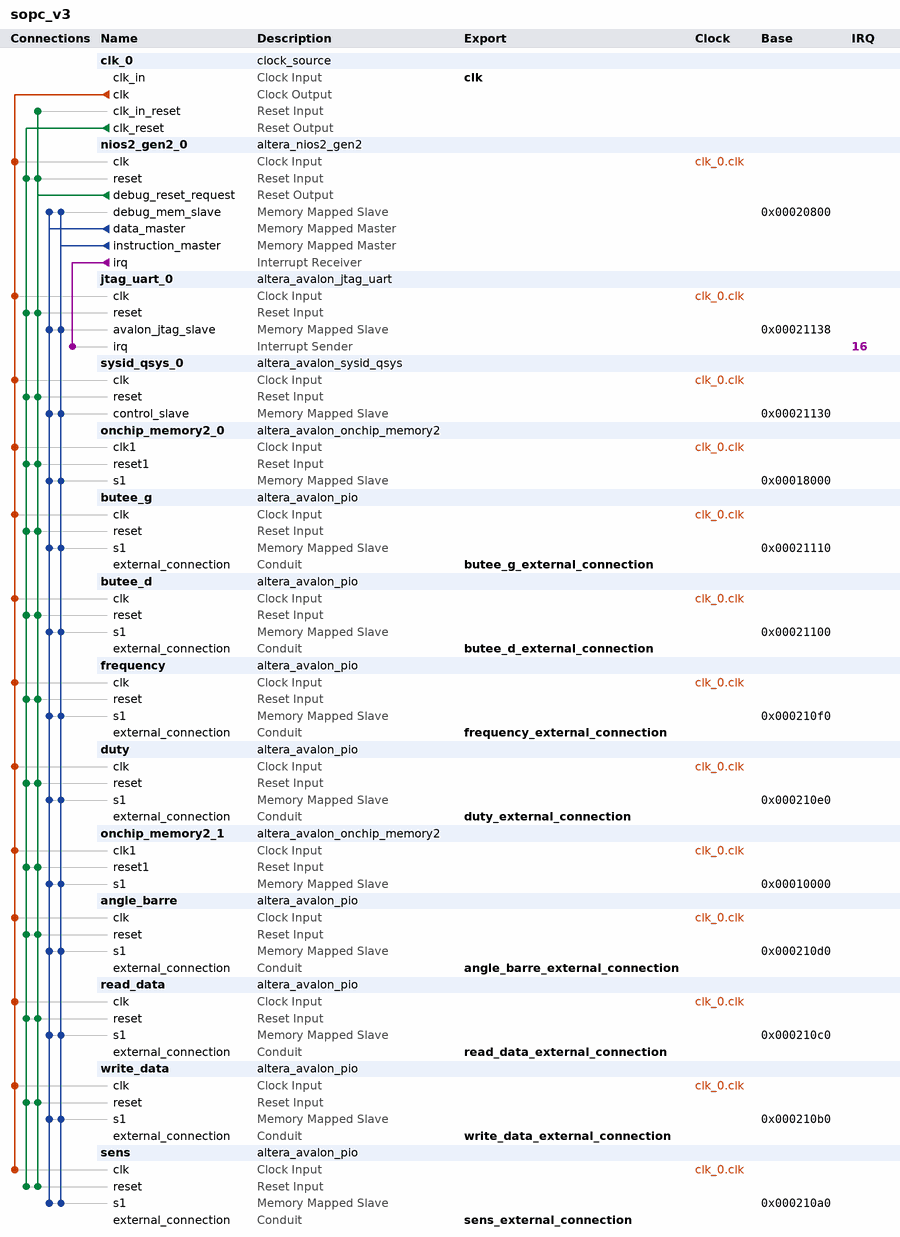
[diagram p0: system contents]
# Platform Designer (Qsys) system sopc_v3, Cyclone IV E EP4CE22F17C6
# Parameters at their usual value, and those the tool derives, are not listed.
package require -exact qsys 18.1
create_system sopc_v3
set_project_property DEVICE_FAMILY {Cyclone IV E}
set_project_property DEVICE EP4CE22F17C6

add_instance clk_0 clock_source 18.1
set_instance_parameter_value clk_0 clockFrequency 50000000

add_instance nios2_gen2_0 altera_nios2_gen2 18.1
set_instance_parameter_value nios2_gen2_0 dcache_size 2048
set_instance_parameter_value nios2_gen2_0 exceptionSlave onchip_memory2_0.s1
set_instance_parameter_value nios2_gen2_0 icache_size 4096
set_instance_parameter_value nios2_gen2_0 impl Tiny
set_instance_parameter_value nios2_gen2_0 resetSlave onchip_memory2_0.s1

add_instance jtag_uart_0 altera_avalon_jtag_uart 18.1
set_instance_parameter_value jtag_uart_0 readIRQThreshold 16
set_instance_parameter_value jtag_uart_0 simInteractiveOptions NO_INTERACTIVE_WINDOWS
set_instance_parameter_value jtag_uart_0 writeIRQThreshold 16

add_instance sysid_qsys_0 altera_avalon_sysid_qsys 18.1
set_instance_parameter_value sysid_qsys_0 id 5639

add_instance onchip_memory2_0 altera_avalon_onchip_memory2 18.1
set_instance_parameter_value onchip_memory2_0 dataWidth 32
set_instance_parameter_value onchip_memory2_0 dualPort false
set_instance_parameter_value onchip_memory2_0 initMemContent true
set_instance_parameter_value onchip_memory2_0 initializationFileName onchip_mem.hex
set_instance_parameter_value onchip_memory2_0 memorySize 20000

add_instance butee_g altera_avalon_pio 18.1
set_instance_parameter_value butee_g direction Output
set_instance_parameter_value butee_g width 12

add_instance butee_d altera_avalon_pio 18.1
set_instance_parameter_value butee_d direction Output
set_instance_parameter_value butee_d width 12

add_instance frequency altera_avalon_pio 18.1
set_instance_parameter_value frequency direction Output
set_instance_parameter_value frequency width 16

add_instance duty altera_avalon_pio 18.1
set_instance_parameter_value duty direction Output
set_instance_parameter_value duty width 16

add_instance onchip_memory2_1 altera_avalon_onchip_memory2 18.1
set_instance_parameter_value onchip_memory2_1 dataWidth 32
set_instance_parameter_value onchip_memory2_1 dualPort false
set_instance_parameter_value onchip_memory2_1 initMemContent true
set_instance_parameter_value onchip_memory2_1 initializationFileName onchip_mem.hex
set_instance_parameter_value onchip_memory2_1 memorySize 20000

add_instance angle_barre altera_avalon_pio 18.1
set_instance_parameter_value angle_barre direction Input
set_instance_parameter_value angle_barre width 12

add_instance read_data altera_avalon_pio 18.1
set_instance_parameter_value read_data direction Output
set_instance_parameter_value read_data width 32

add_instance write_data altera_avalon_pio 18.1
set_instance_parameter_value write_data direction Input
set_instance_parameter_value write_data width 32

add_instance sens altera_avalon_pio 18.1
set_instance_parameter_value sens direction Output
set_instance_parameter_value sens width 1

# connections
add_connection clk_0.clk angle_barre.clk clock
add_connection clk_0.clk butee_d.clk clock
add_connection clk_0.clk butee_g.clk clock
add_connection clk_0.clk duty.clk clock
add_connection clk_0.clk frequency.clk clock
add_connection clk_0.clk jtag_uart_0.clk clock
add_connection clk_0.clk nios2_gen2_0.clk clock
add_connection clk_0.clk onchip_memory2_0.clk1 clock
add_connection clk_0.clk onchip_memory2_1.clk1 clock
add_connection clk_0.clk read_data.clk clock
add_connection clk_0.clk sens.clk clock
add_connection clk_0.clk sysid_qsys_0.clk clock
add_connection clk_0.clk write_data.clk clock
add_connection clk_0.clk_reset angle_barre.reset reset
add_connection clk_0.clk_reset butee_d.reset reset
add_connection clk_0.clk_reset butee_g.reset reset
add_connection clk_0.clk_reset duty.reset reset
add_connection clk_0.clk_reset frequency.reset reset
add_connection clk_0.clk_reset jtag_uart_0.reset reset
add_connection clk_0.clk_reset nios2_gen2_0.reset reset
add_connection clk_0.clk_reset onchip_memory2_0.reset1 reset
add_connection clk_0.clk_reset onchip_memory2_1.reset1 reset
add_connection clk_0.clk_reset read_data.reset reset
add_connection clk_0.clk_reset sens.reset reset
add_connection clk_0.clk_reset sysid_qsys_0.reset reset
add_connection clk_0.clk_reset write_data.reset reset
add_connection nios2_gen2_0.debug_reset_request angle_barre.reset reset
add_connection nios2_gen2_0.debug_reset_request butee_d.reset reset
add_connection nios2_gen2_0.debug_reset_request butee_g.reset reset
add_connection nios2_gen2_0.debug_reset_request clk_0.clk_in_reset reset
add_connection nios2_gen2_0.debug_reset_request duty.reset reset
add_connection nios2_gen2_0.debug_reset_request frequency.reset reset
add_connection nios2_gen2_0.debug_reset_request jtag_uart_0.reset reset
add_connection nios2_gen2_0.debug_reset_request nios2_gen2_0.reset reset
add_connection nios2_gen2_0.debug_reset_request onchip_memory2_0.reset1 reset
add_connection nios2_gen2_0.debug_reset_request onchip_memory2_1.reset1 reset
add_connection nios2_gen2_0.debug_reset_request read_data.reset reset
add_connection nios2_gen2_0.debug_reset_request sens.reset reset
add_connection nios2_gen2_0.debug_reset_request sysid_qsys_0.reset reset
add_connection nios2_gen2_0.debug_reset_request write_data.reset reset
add_connection nios2_gen2_0.data_master angle_barre.s1 avalon
set_connection_parameter_value nios2_gen2_0.data_master/angle_barre.s1 baseAddress 0x000210d0
add_connection nios2_gen2_0.data_master butee_d.s1 avalon
set_connection_parameter_value nios2_gen2_0.data_master/butee_d.s1 baseAddress 0x00021100
add_connection nios2_gen2_0.data_master butee_g.s1 avalon
set_connection_parameter_value nios2_gen2_0.data_master/butee_g.s1 baseAddress 0x00021110
add_connection nios2_gen2_0.data_master duty.s1 avalon
set_connection_parameter_value nios2_gen2_0.data_master/duty.s1 baseAddress 0x000210e0
add_connection nios2_gen2_0.data_master frequency.s1 avalon
set_connection_parameter_value nios2_gen2_0.data_master/frequency.s1 baseAddress 0x000210f0
add_connection nios2_gen2_0.data_master jtag_uart_0.avalon_jtag_slave avalon
set_connection_parameter_value nios2_gen2_0.data_master/jtag_uart_0.avalon_jtag_slave baseAddress 0x00021138
add_connection nios2_gen2_0.data_master nios2_gen2_0.debug_mem_slave avalon
set_connection_parameter_value nios2_gen2_0.data_master/nios2_gen2_0.debug_mem_slave baseAddress 0x00020800
add_connection nios2_gen2_0.data_master onchip_memory2_0.s1 avalon
set_connection_parameter_value nios2_gen2_0.data_master/onchip_memory2_0.s1 baseAddress 0x00018000
add_connection nios2_gen2_0.data_master onchip_memory2_1.s1 avalon
set_connection_parameter_value nios2_gen2_0.data_master/onchip_memory2_1.s1 baseAddress 0x00010000
add_connection nios2_gen2_0.data_master read_data.s1 avalon
set_connection_parameter_value nios2_gen2_0.data_master/read_data.s1 baseAddress 0x000210c0
add_connection nios2_gen2_0.data_master sens.s1 avalon
set_connection_parameter_value nios2_gen2_0.data_master/sens.s1 baseAddress 0x000210a0
add_connection nios2_gen2_0.data_master sysid_qsys_0.control_slave avalon
set_connection_parameter_value nios2_gen2_0.data_master/sysid_qsys_0.control_slave baseAddress 0x00021130
add_connection nios2_gen2_0.data_master write_data.s1 avalon
set_connection_parameter_value nios2_gen2_0.data_master/write_data.s1 baseAddress 0x000210b0
add_connection nios2_gen2_0.instruction_master angle_barre.s1 avalon
set_connection_parameter_value nios2_gen2_0.instruction_master/angle_barre.s1 baseAddress 0x000210d0
add_connection nios2_gen2_0.instruction_master butee_d.s1 avalon
set_connection_parameter_value nios2_gen2_0.instruction_master/butee_d.s1 baseAddress 0x00021100
add_connection nios2_gen2_0.instruction_master butee_g.s1 avalon
set_connection_parameter_value nios2_gen2_0.instruction_master/butee_g.s1 baseAddress 0x00021110
add_connection nios2_gen2_0.instruction_master duty.s1 avalon
set_connection_parameter_value nios2_gen2_0.instruction_master/duty.s1 baseAddress 0x000210e0
add_connection nios2_gen2_0.instruction_master frequency.s1 avalon
set_connection_parameter_value nios2_gen2_0.instruction_master/frequency.s1 baseAddress 0x000210f0
add_connection nios2_gen2_0.instruction_master jtag_uart_0.avalon_jtag_slave avalon
set_connection_parameter_value nios2_gen2_0.instruction_master/jtag_uart_0.avalon_jtag_slave baseAddress 0x00021138
add_connection nios2_gen2_0.instruction_master nios2_gen2_0.debug_mem_slave avalon
set_connection_parameter_value nios2_gen2_0.instruction_master/nios2_gen2_0.debug_mem_slave baseAddress 0x00020800
add_connection nios2_gen2_0.instruction_master onchip_memory2_0.s1 avalon
set_connection_parameter_value nios2_gen2_0.instruction_master/onchip_memory2_0.s1 baseAddress 0x00018000
add_connection nios2_gen2_0.instruction_master onchip_memory2_1.s1 avalon
set_connection_parameter_value nios2_gen2_0.instruction_master/onchip_memory2_1.s1 baseAddress 0x00010000
add_connection nios2_gen2_0.instruction_master read_data.s1 avalon
set_connection_parameter_value nios2_gen2_0.instruction_master/read_data.s1 baseAddress 0x000210c0
add_connection nios2_gen2_0.instruction_master sens.s1 avalon
set_connection_parameter_value nios2_gen2_0.instruction_master/sens.s1 baseAddress 0x000210a0
add_connection nios2_gen2_0.instruction_master sysid_qsys_0.control_slave avalon
set_connection_parameter_value nios2_gen2_0.instruction_master/sysid_qsys_0.control_slave baseAddress 0x00021130
add_connection nios2_gen2_0.instruction_master write_data.s1 avalon
set_connection_parameter_value nios2_gen2_0.instruction_master/write_data.s1 baseAddress 0x000210b0
add_connection nios2_gen2_0.irq jtag_uart_0.irq interrupt
set_connection_parameter_value nios2_gen2_0.irq/jtag_uart_0.irq irqNumber 16

# exported interfaces
add_interface angle_barre_external_connection conduit end
set_interface_property angle_barre_external_connection EXPORT_OF angle_barre.external_connection
add_interface butee_d_external_connection conduit end
set_interface_property butee_d_external_connection EXPORT_OF butee_d.external_connection
add_interface butee_g_external_connection conduit end
set_interface_property butee_g_external_connection EXPORT_OF butee_g.external_connection
add_interface clk clock sink
set_interface_property clk EXPORT_OF clk_0.clk_in
add_interface duty_external_connection conduit end
set_interface_property duty_external_connection EXPORT_OF duty.external_connection
add_interface frequency_external_connection conduit end
set_interface_property frequency_external_connection EXPORT_OF frequency.external_connection
add_interface read_data_external_connection conduit end
set_interface_property read_data_external_connection EXPORT_OF read_data.external_connection
add_interface sens_external_connection conduit end
set_interface_property sens_external_connection EXPORT_OF sens.external_connection
add_interface write_data_external_connection conduit end
set_interface_property write_data_external_connection EXPORT_OF write_data.external_connection

set_interconnect_requirement {$system} qsys_mm.clockCrossingAdapter HANDSHAKE
set_interconnect_requirement {$system} qsys_mm.enableEccProtection FALSE
set_interconnect_requirement {$system} qsys_mm.insertDefaultSlave FALSE
set_interconnect_requirement {$system} qsys_mm.maxAdditionalLatency 1

save_system sopc_v3.qsys
